# EAGLE schematic Mainboard (EAGLE 8.5.0)
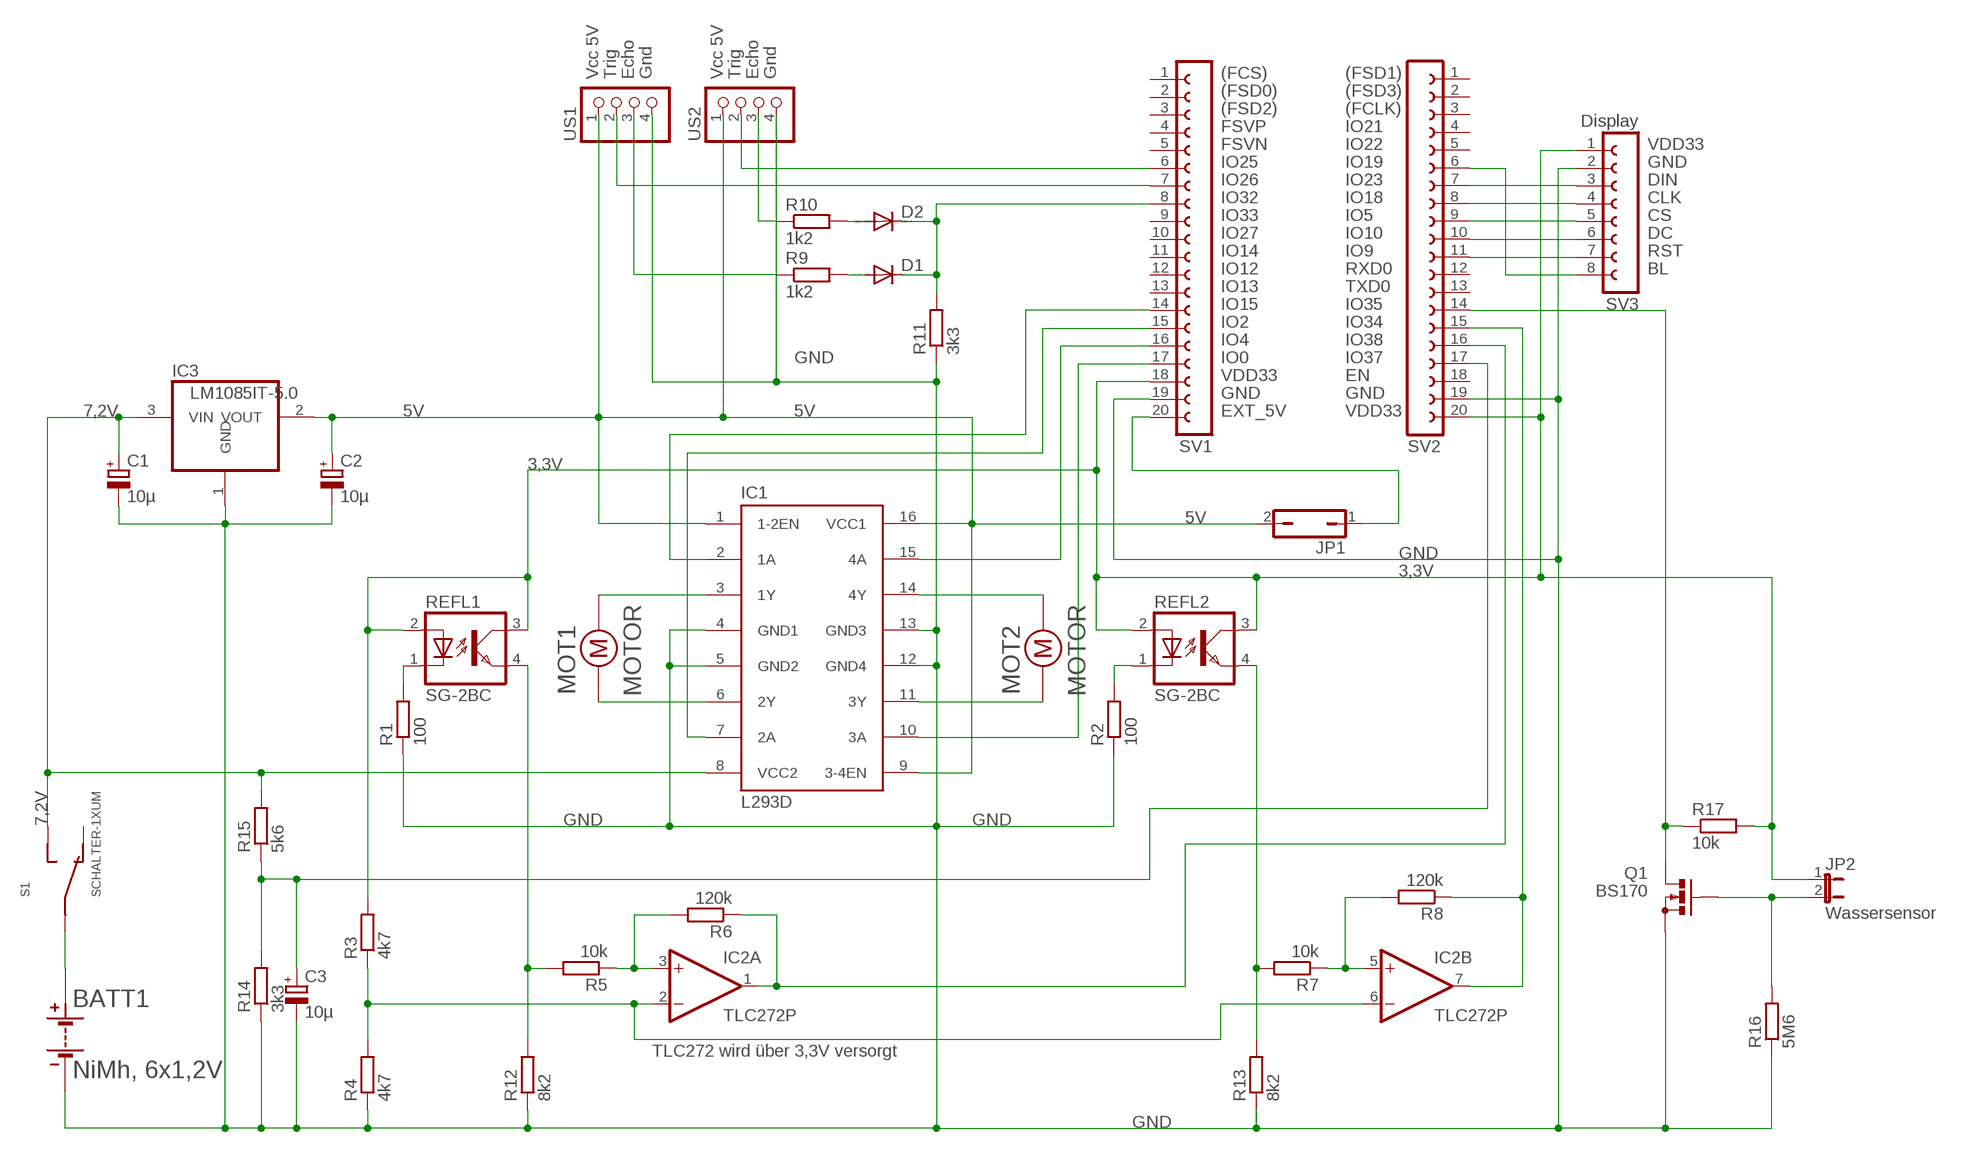
[diagram p0: schematic, sheet 1]

## Parts
BATT1  NiMh, 6x1,2V  BATTERIEN  [DUMMY2P]
C1  10µ  CPOL-EUE3.5-10  [E3,5-10]
C2  10µ  CPOL-EUE3.5-10  [E3,5-10]
C3  10µ  CPOL-EUE3.5-10  [E3,5-10]
D1  1N4148DO35-10  [DO35-10]
D2  1N4148DO35-10  [DO35-10]
IC1  L293D  [DIL16]
IC2  TLC272P  [DIL08]
IC3  LM1085IT-5.0  REG1117F  [DD-3]
JP1  JP1Q  [JP1]
JP2  Wassersensor  JP1E  [JP1]
MOT1  MOTOR  [DUMMY2P]
MOT2  MOTOR  [DUMMY2P]
Q1  BS170  [SOT54E]
R1  100  R-EU_RDH/15  [RDH/15]
R2  100  R-EU_RDH/15  [RDH/15]
R3  4k7  R-EU_RDH/15  [RDH/15]
R4  4k7  R-EU_RDH/15  [RDH/15]
R5  10k  R-EU_RDH/15  [RDH/15]
R6  120k  R-EU_RDH/15  [RDH/15]
R7  10k  R-EU_RDH/15  [RDH/15]
R8  120k  R-EU_RDH/15  [RDH/15]
R9  1k2  R-EU_RDH/15  [RDH/15]
R10  1k2  R-EU_RDH/15  [RDH/15]
R11  3k3  R-EU_RDH/15  [RDH/15]
R12  8k2  R-EU_RDH/15  [RDH/15]
R13  8k2  R-EU_RDH/15  [RDH/15]
R14  3k3  R-EU_RDH/15  [RDH/15]
R15  5k6  R-EU_RDH/15  [RDH/15]
R16  5M6  R-EU_RDH/15  [RDH/15]
R17  10k  R-EU_RDH/15  [RDH/15]
REFL1  SG-2BC  REFLEXKOPPLERSG-2BC  [DIL04]
REFL2  SG-2BC  REFLEXKOPPLERSG-2BC  [DIL04]
S1  SCHALTER-1XUM  [DUMMY3P]
SV1  FE20-1  [FE20]
SV2  FE20-1  [FE20]
SV3  Display  FE08-1  [FE08]
US1  PINHD-1X4  [1X04]
US2  PINHD-1X4  [1X04]

## Nets
3,3V: JP2.1 R3.2 R17.2 REFL1.2(A) REFL1.3(COL) REFL2.2(A) REFL2.3(COL) SV1.18 SV2.20 SV3.1
5V: C2.+ IC1.1(1-2EN) IC1.9(3-4EN) IC1.16(VCC1) IC3.2(VOUT) JP1.2 US1.1 US2.1
7,2V: C1.+ IC1.8(VCC2) IC3.3(VIN) R15.2 S1.P$2
GND: BATT1.P$1(M) C1.- C2.- C3.- IC1.4(GND1) IC1.5(GND2) IC1.12(GND4) IC1.13(GND3) IC3.1(GND) Q1.S R1.1 R2.1 R4.1 R11.1 R12.1 R13.1 R14.1 R16.1 SV1.19 SV2.19 SV3.2 US1.4 US2.4
N$1: D1.A R9.2
N$2: D2.A R10.2
N$3: D1.C D2.C R11.2 SV1.8
N$4: IC1.3(1Y) MOT1.P$2
N$5: IC1.6(2Y) MOT1.P$1
N$6: IC1.14(4Y) MOT2.P$2
N$7: IC1.11(3Y) MOT2.P$1
N$8: SV2.7 SV3.3
N$9: R1.2 REFL1.1(C)
N$10: R2.2 REFL2.1(C)
N$11: SV2.8 SV3.4
N$12: SV1.7 US1.2
N$13: SV1.6 US2.2
N$14: R9.1 US1.3
N$15: R10.1 US2.3
N$16: SV2.9 SV3.5
N$17: SV2.10 SV3.6
N$18: SV2.11 SV3.7
N$19: R5.2 R12.2 REFL1.4(EMIT)
N$20: SV2.6 SV3.8
N$21: IC2.1(A:OUT) R6.1 SV2.16
N$22: IC2.3(A:+IN) R5.1 R6.2
N$23: IC2.2(A:-IN) IC2.6(B:-IN) R3.1 R4.2
N$24: IC2.5(B:+IN) R7.1 R8.2
N$25: C3.+ R14.2 R15.1 SV2.17
N$26: R7.2 R13.2 REFL2.4(EMIT)
N$27: JP1.1 SV1.20
N$28: IC2.7(B:OUT) R8.1 SV2.15
N$29: IC1.10(3A) SV1.17
N$30: IC1.15(4A) SV1.16
N$31: IC1.2(1A) SV1.14
N$32: IC1.7(2A) SV1.15
N$34: Q1.D R17.1 SV2.14
N$35: JP2.2 Q1.G R16.2
P: BATT1.P$2(P) S1.P$1
Unconnected: S1.P$3 SV1.1 SV1.2 SV1.3 SV1.4 SV1.5 SV1.9 SV1.10 SV1.11 SV1.12 SV1.13 SV2.1 SV2.2 SV2.3 SV2.4 SV2.5 SV2.12 SV2.13 SV2.18

## Notes on the sheet
- Vcc 5V | Trig | Echo | Gnd | Vcc 5V | Trig | Echo | Gnd | (FCS) | (FSD1)
- (FSD0) | (FSD3)
- (FSD2) | (FCLK)
- FSVP | IO21
- FSVN | IO22 | VDD33
- IO25 | IO19 | GND
- IO26 | IO23 | DIN
- IO32 | IO18 | CLK
- IO33 | IO5 | CS
- IO27 | IO10 | DC
- IO14 | IO9 | RST
- IO12 | RXD0 | BL
- IO13 | TXD0
- IO15 | IO35
- IO2 | IO34
- IO4 | IO38
- IO0 | IO37
- VDD33 | EN
- GND | GND
- EXT_5V | VDD33
- TLC272 wird über 3,3V versorgt

## Power pins joined to a net without a drawn wire
V+: IC2.8(P:V+)
V-: IC2.4(P:V-)

## Library data of the parts
BATT1 = bs_lib:BATTERIEN
C1-C3 = rcl:CPOL-EU: POLARIZED CAPACITOR, European symbol; SPICEPREFIX: C
D1 D2 = diode:1N4148: DIODE high speed (Philips)
IC1 = st-microelectronics:L293D: PUSH-PULL 4 CHANNEL DRIVER; MPN: L293D; OC_FARNELL: 9589619; OC_NEWARK: 56P8249
IC2 = linear:TLC272: OP AMP
IC3 = burr-brown:REG1117: 800mA and 1A Low Dropout (LDO) Positive Regulator 1.8V, 2.5V, 2.85V, 3.3V, 5V, and Adj; MF: TEXAS INSTRUMENTS; MPN: REG1117FAKTTT; OC_FARNELL: 1296120; OC_NEWARK: 87H2562
JP1 = jumper:JP1Q: JUMPER
JP2 = jumper:JP1E: JUMPER
MOT1 MOT2 = bs_lib:MOTOR
Q1 = transistor-small-signal:BS170: N-CHANNEL MOS FET
R1-R17 = rcl:R-EU_: RESISTOR, European symbol; SPICEPREFIX: R
REFL1 REFL2 = bs_lib:REFLEXKOPPLER: SIEMENS OPTO COUPLER
S1 = bs_lib:SCHALTER-1XUM
SV1 SV2 = con-lsta:FE20-1: FEMALE HEADER; OC_FARNELL: unknown; OC_NEWARK: unknown
SV3 = con-lsta:FE08-1: FEMALE HEADER; OC_FARNELL: unknown; OC_NEWARK: unknown
US1 US2 = pinhead:PINHD-1X4: PIN HEADER